# EAGLE design NAND (EAGLE 5.11)
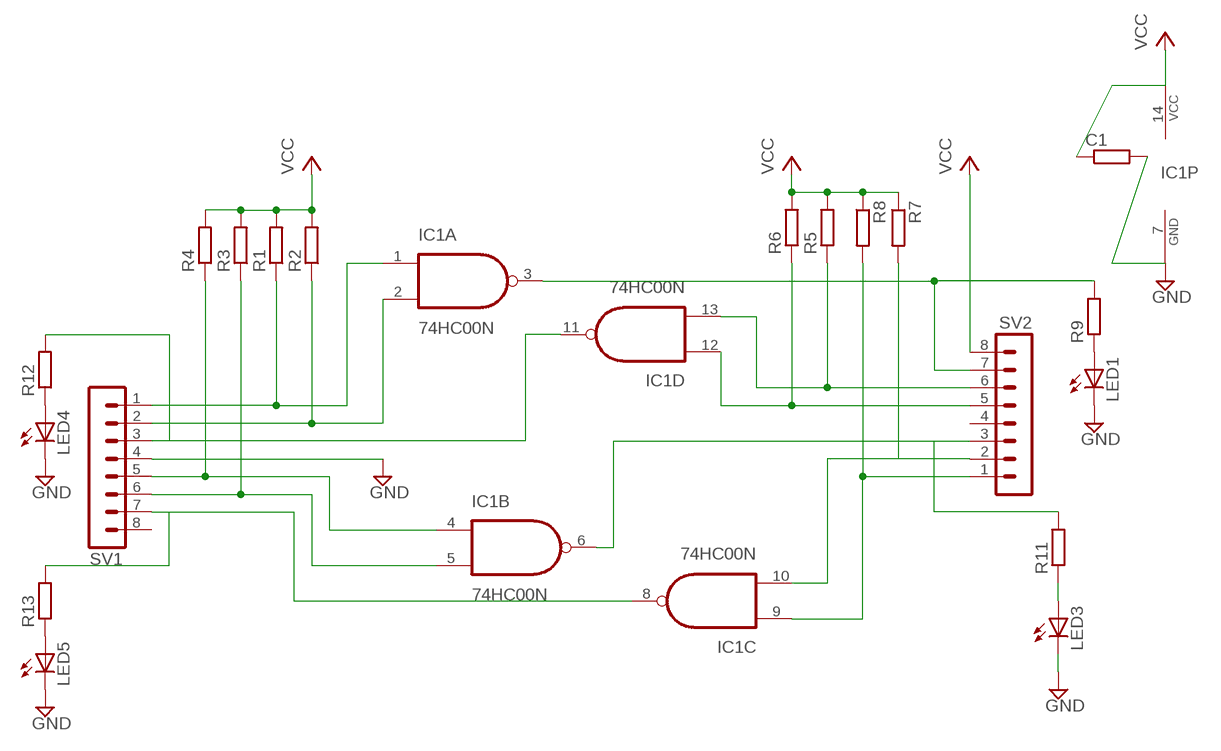
[diagram p0: schematic, sheet 1]

## Parts
C1  R-EU_M2012  [M2012]
IC1  74HC00N  [DIL14]
LED1  LED3MM  [LED3MM]
LED3  LED3MM  [LED3MM]
LED4  LED3MM  [LED3MM]
LED5  LED3MM  [LED3MM]
R1  R-EU_0204/5  [0204/5]
R2  R-EU_0204/5  [0204/5]
R3  R-EU_0204/5  [0204/5]
R4  R-EU_0204/5  [0204/5]
R5  R-EU_0204/5  [0204/5]
R6  R-EU_0204/5  [0204/5]
R7  R-EU_0204/5  [0204/5]
R8  R-EU_0204/5  [0204/5]
R9  R-EU_0204/5  [0204/5]
R11  R-EU_0204/7  [0204/7]
R12  R-EU_M2012  [M2012]
R13  R-EU_0204/5  [0204/5]
SV1  MA08-1  [MA08-1]
SV2  MA08-1  [MA08-1]

## Nets
GND: C1.2 IC1.7(P:GND) LED1.K(C) LED3.K(C) LED4.K(C) LED5.K(C) SV1.4
N$1: IC1.4(B:I0) R4.1 SV1.5
N$3: IC1.1(A:I0) R1.1 SV1.1
N$4: IC1.2(A:I1) R2.1 SV1.2
N$5: IC1.3(A:O) R9.2 SV2.7
N$7: IC1.13(D:I1) R5.1 SV2.6
N$8: IC1.12(D:I0) R6.1 SV2.5
N$9: IC1.5(B:I1) R3.1 SV1.6
N$11: IC1.9(C:I0) R8.2 SV2.1
N$14: LED1.A R9.1
N$18: IC1.10(C:I1) R7.2 SV2.2
N$19: IC1.6(B:O) R11.2 SV2.3
N$20: LED3.A R11.1
N$21: IC1.11(D:O) R12.2 SV1.3
N$22: LED4.A R12.1
N$23: IC1.8(C:O) R13.2 SV1.7
N$24: LED5.A R13.1
VCC: C1.1 IC1.14(P:VCC) R1.2 R2.2 R3.2 R4.2 R5.2 R6.2 R7.1 R8.1 SV2.8
Unconnected: SV1.8 SV2.4

## Library data of the parts
C1 R1-R9 R11-R13 = resistor:R-EU_: RESISTOR, European symbol
IC1 = My Library:74*00: Quad 2-input NAND gate
LED1 LED3-LED5 = led:LED: LED OSRAM: - CHIPLED LG R971, LG N971, LY N971, LG Q971, LY Q971, LO R971, LY R971 LH N974, LH R974 LS Q976, LO Q976, LY Q976 LO Q996 - Hyper CHIPLED LW Q18S LB Q993, LB Q99A, LB R99A - SideLED LS A670, LO A670, LY A670, LG A670, LP A670 LB A673, LV A673, LT A673, LW A673 LH A674 LY A675 LS A676, LA A676, LO A676, LY A676, LW A676 LS A679, LY A679, LG A679 - Hyper Micro SIDELED® LS Y876, LA Y876, LO Y876, LY Y876 LT Y87S - SmartLED LW L88C, LW L88S LB L89C, LB L89S, LG L890 LS L89K, LO L89K, LY L89K LS L896, LA L896, LO L896, LY L896 - TOPLED LS T670, LO T670, LY T670, LG T670, LP T670 LSG T670, LSP T670, LSY T670, LOP T670, LYG T670 LG T671, LOG T671, LSG T671 LB T673, LV T673, LT T673, LW T673 LH T674 LS T676, LA T676, LO T676, LY T676, LB T676, LH T676, LSB T676, LW T676 LB T67C, LV T67C, LT T67C, LS T67K, LO T67K, LY T67K, LW E67C LS E67B, LA E67B, LO E67B, LY E67B, LB E67C, LV E67C, LT E67C LW T67C LS T679, LY T679, LG T679 LS T770, LO T770, LY T770, LG T770, LP T770 LB T773, LV T773, LT T773, LW T773 LH T774 LS E675, LA E675, LY E675, LS T675 LS T776, LA T776, LO T776, LY T776, LB T776 LHGB T686 LT T68C, LB T68C - Hyper Mini TOPLED® LB M676 - Mini TOPLED Santana® LG M470 LS M47K, LO M47K, LY M47K Source: http://www.osram.convergy.de LUXEON: - LUMILED® LXK2-PW12-R00, LXK2-PW12-S00, LXK2-PW14-U00, LXK2-PW14-V00 LXK2-PM12-R00, LXK2-PM12-S00, LXK2-PM14-U00 LXK2-PE12-Q00, LXK2-PE12-R00, LXK2-PE12-S00, LXK2-PE14-T00, LXK2-PE14-U00 LXK2-PB12-K00, LXK2-PB12-L00, LXK2-PB12-M00, LXK2-PB14-N00, LXK2-PB14-P00, LXK2-PB14-Q00 LXK2-PR12-L00, LXK2-PR12-M00, LXK2-PR14-Q00, LXK2-PR14-R00 LXK2-PD12-Q00, LXK2-PD12-R00, LXK2-PD12-S00 LXK2-PH12-R00, LXK2-PH12-S00 LXK2-PL12-P00, LXK2-PL12-Q00, LXK2-PL12-R00 Source: www.luxeon.com KINGBRIGHT: KA-3528ASYC Source: www.kingbright.com
SV1 SV2 = con-lstb:MA08-1: PIN HEADER; OC_FARNELL: unknown; OC_NEWARK: unknown

## Board
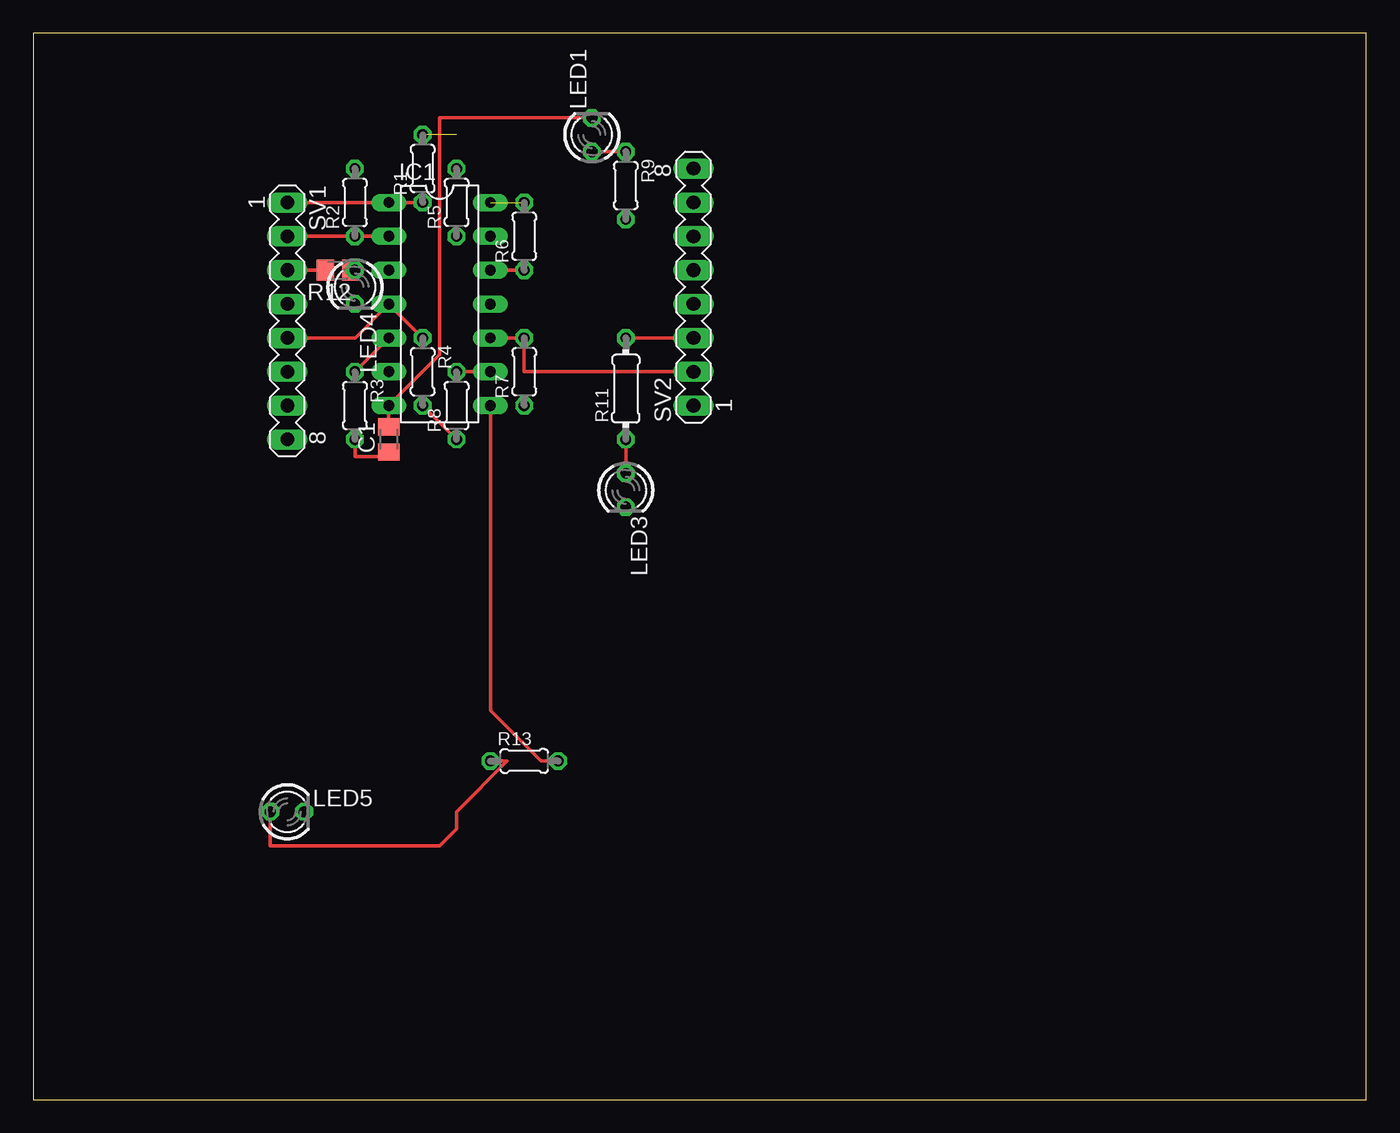
[diagram p1: board, top side]
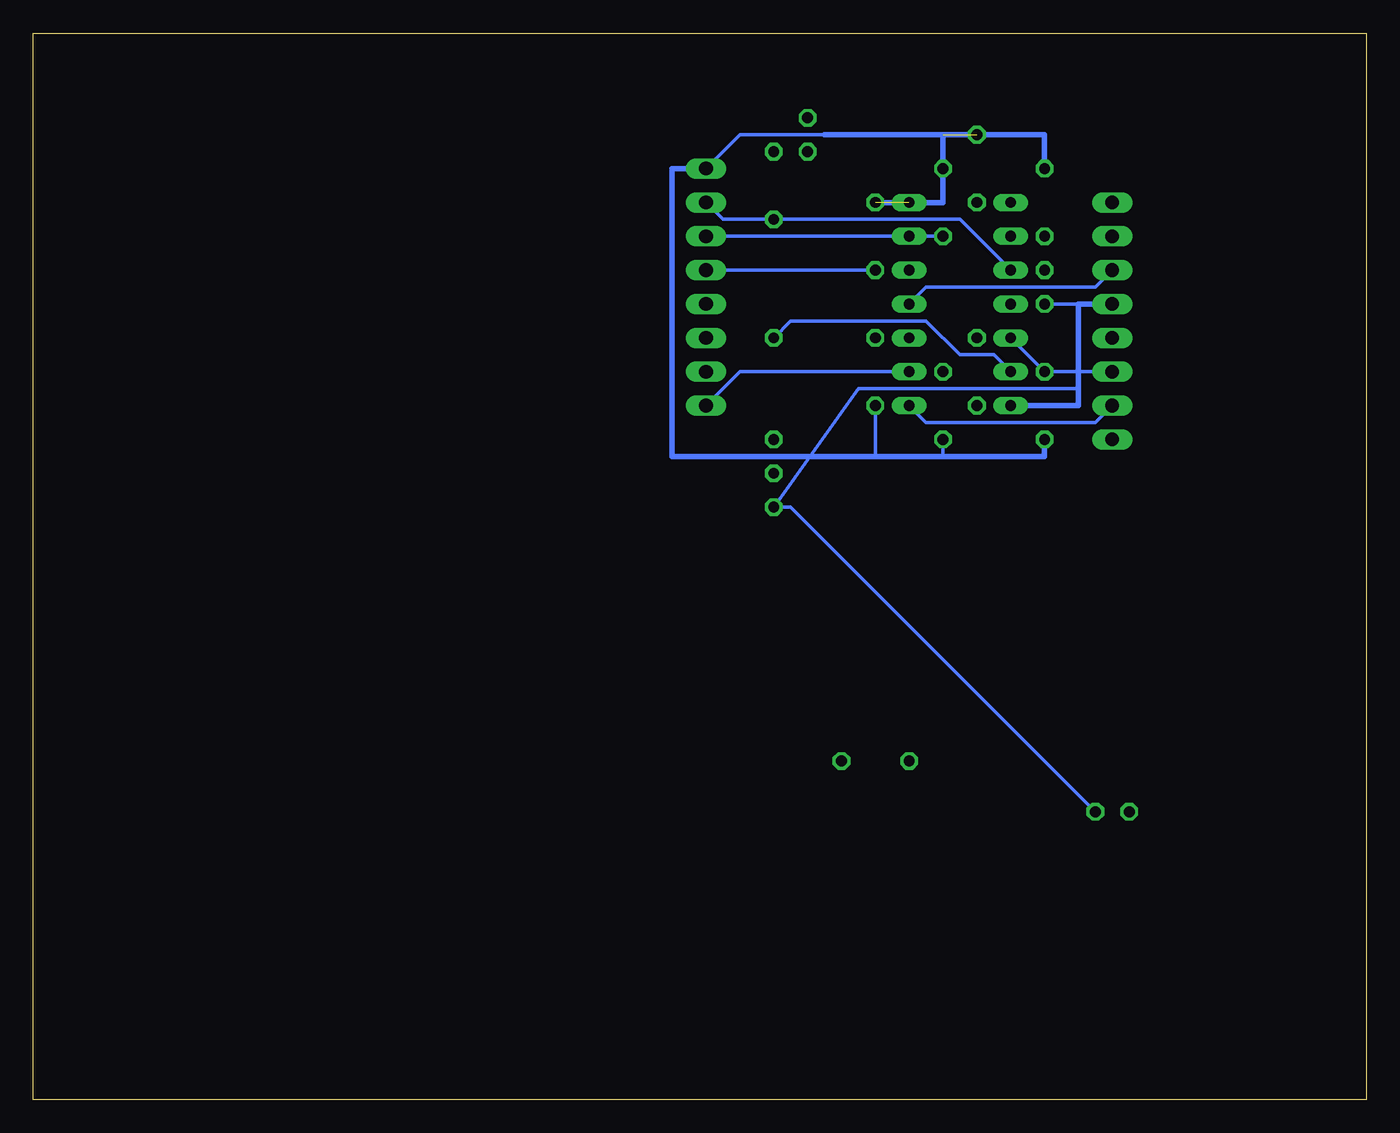
[diagram p2: board, bottom side, seen from below]

Size 100 x 80 mm. Coordinates in mm from the lower left corner, seen from the top.
Outline: 0,0 100,0 100,80 0,80 0,0
Copper layers (1*16): Top 0.035mm / dielectric 1.5mm / Bottom 0.035mm
Design rules "default": minimum track width 10mil, minimum drill 24mil, track to track 8mil, track to pad 8mil, pad to pad 8mil, via to via 8mil, smd to smd 8mil, copper to edge 40mil, drill to drill 8mil, minimum pad ring 10mil, minimum via ring 8mil, stop-mask expansion 4mil, vias tented up to drill 0mil, thermal gap 10mil

### Footprints (pad centres in the part's own frame; a part is rotated, then mirrored left to right if it is on the bottom)
M2012 = smd 1.3 x 1.6: 1 -0.95,0; 2 0.95,0
DIL14 = drill 0.813 long: 1 -7.62,-3.81; 2 -5.08,-3.81; 3 -2.54,-3.81; 4 0,-3.81; 5 2.54,-3.81; 6 5.08,-3.81; 7 7.62,-3.81; 8 7.62,3.81; 9 5.08,3.81; 10 2.54,3.81; 11 0,3.81; 12 -2.54,3.81; 13 -5.08,3.81; 14 -7.62,3.81
LED3MM = drill 0.813 octagon: A -1.27,0; K 1.27,0
0204/5 = drill 0.813 octagon: 1 -2.54,0; 2 2.54,0
0204/7 = drill 0.813 octagon: 1 -3.81,0; 2 3.81,0
MA08-1 = drill 1.016 long: 1 -8.89,0; 2 -6.35,0; 3 -3.81,0; 4 -1.27,0; 5 1.27,0; 6 3.81,0; 7 6.35,0; 8 8.89,0

### Placement (x,y rotation side)
C1  26.67,49.53 90 top
IC1  30.48,59.69 270 top
LED1  41.91,72.39 90 top
LED3  44.45,45.72 270 top
LED4  24.13,60.96 270 top
LED5  19.05,21.59 0 top
R1  29.21,69.85 90 top
R2  24.13,67.31 90 top
R3  24.13,52.07 270 top
R4  29.21,54.61 270 top
R5  31.75,67.31 90 top
R6  36.83,64.77 90 top
R7  36.83,54.61 90 top
R8  31.75,52.07 90 top
R9  44.45,68.58 270 top
R11  44.45,53.34 90 top
R12  22.86,62.23 180 top
R13  36.83,25.4 0 top
SV1  19.05,58.42 270 top
SV2  49.53,60.96 90 top

### Tracks (layer width: path | path; a pad name or v marks a point on that pad's centre or on a via)
GND
  Top 0.254: C1.2 26.67,50.8 IC1.7 30.48,55.88 30.48,73.66 LED1.K
  Bottom 0.254: 21.59,53.34 38.1,53.34 LED3.K 43.18,44.45 LED5.K | 21.59,59.69 LED4.K
  Bottom 0.406: SV1.4 21.59,59.69 21.59,53.34 21.59,52.07 IC1.7
N$1
  Top 0.254: R4.1 IC1.4 24.13,57.15 SV1.5
N$3
  Top 0.254: IC1.1 R1.1 SV1.1
N$4
  Top 0.254: SV1.2 R2.1 IC1.2
N$5
  Bottom 0.254: IC1.3 30.48,66.04 R9.2 48.26,66.04 SV2.7
N$7
  Bottom 0.254: IC1.13 R5.1 SV2.6
N$8
  Top 0.254: IC1.12 R6.1
  Bottom 0.254: R6.1 SV2.5
N$9
  Top 0.254: R3.1 IC1.5
  Bottom 0.254: SV1.6 20.32,54.61 R3.1 IC1.5
N$11
  Top 0.254: R8.2 IC1.9
  Bottom 0.254: SV2.1 46.99,54.61 IC1.9
N$14
  Top 0.254: LED1.A R9.1
N$18
  Top 0.254: IC1.10 R7.2 36.83,54.61 SV2.2
N$19
  Top 0.254: R11.2 SV2.3 R11.2
  Bottom 0.254: IC1.6 27.94,55.88 30.48,55.88 33.02,58.42 43.18,58.42 R11.2
N$20
  Top 0.254: LED3.A R11.1
N$21
  Top 0.254: SV1.3 21.59,62.23 R12.2
  Bottom 0.254: IC1.11 33.02,60.96 20.32,60.96 SV1.3
N$22
  Top 0.254: R12.1 LED4.A
N$23
  Top 0.254: R13.2 38.1,25.4 34.29,29.21 IC1.8
  Bottom 0.254: SV1.7 20.32,50.8 33.02,50.8 IC1.8
N$24
  Top 0.254: LED5.A 17.78,19.05 30.48,19.05 31.75,20.32 31.75,21.59 35.56,25.4 R13.1
VCC  (2 unrouted)
  Top 0.254: R3.2 24.13,48.26 26.67,48.26 C1.1 | R8.1 R4.2
  Bottom 0.254: 40.64,72.39 46.99,72.39 SV2.8 | 31.75,72.39 R5.2 | 31.75,48.26 R8.1 | 36.83,48.26 R7.1
  Bottom 0.406: R2.2 24.13,72.39 31.75,72.39 | 31.75,72.39 39.37,72.39 40.64,72.39 | R3.2 24.13,48.26 31.75,48.26 36.83,48.26 39.37,48.26 52.07,48.26 52.07,69.85 SV2.8 | R6.2 31.75,67.31 31.75,72.39